# EAGLE schematic X10Relay (EAGLE 7.3.0)
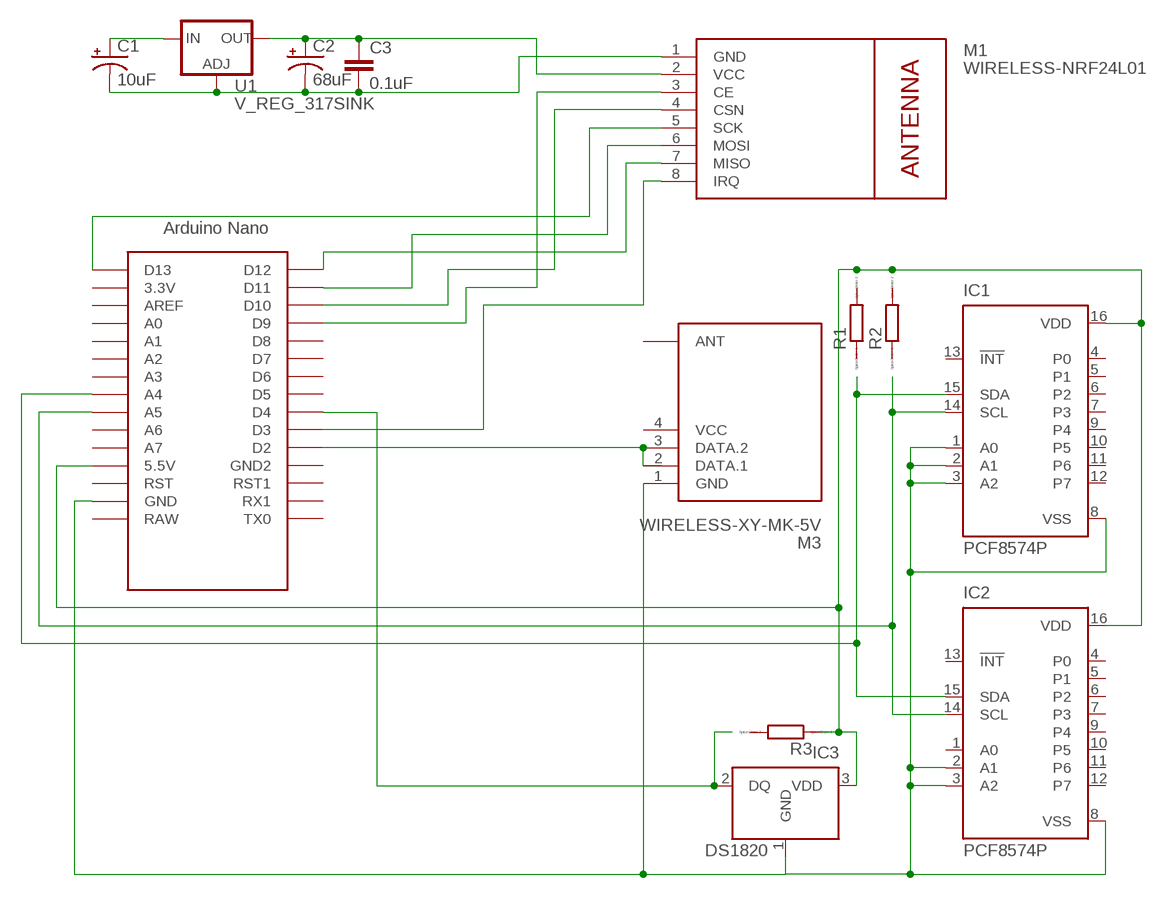
[diagram p0: schematic, sheet 1]

## Parts
C1  10uF  CAP_POL1206  [EIA3216]
C2  68uF  CAP_POL1206  [EIA3216]
C3  0.1uF  CAPEZ  [CAP-PTH-SMALLEZ]
IC1  PCF8574P  [DIL16]
IC2  PCF8574P  [DIL16]
IC3  DS1820  [TO-92]
M1  WIRELESS-NRF24L01  [WIRELESS-NRF24L01]
M3  WIRELESS-XY-MK-5V  [WIRELESS-XY-MK-5V]
R1  R  [R0805]
R2  R  [R0805]
R3  R  [R0805]
U1  V_REG_317SINK  [TO220-ADJ]
U$1  NANO  [NANO]

## Nets
N$1: IC1.1(A0) IC1.2(A1) IC1.3(A2) IC1.8(VSS) IC2.2(A1) IC2.3(A2) IC2.8(VSS) IC3.1(GND) M3.1(GND) U$1.GND
N$2: IC1.15(SDA) IC2.15(SDA) U$1.A4
N$3: C1.A(+) U1.IN
N$4: IC1.14(SCL) IC2.14(SCL) U$1.A5
N$5: C2.A(+) C3.1 M1.2(VCC) U1.OUT
N$6: M1.3(CE) U$1.D9
N$7: M1.4(CSN) U$1.D10
N$8: M1.7(MISO) U$1.D12
N$9: M1.6(MOSI) U$1.D11
N$10: M1.5(SCK) U$1.D13
N$11: M3.3(DATA.2) U$1.D2
N$12: IC1.16(VDD) IC2.16(VDD) IC3.3(VDD) R3.1 U$1.5V(5.5V)
N$13: M1.8(IRQ) U$1.D3
N$20: IC3.2(DQ) U$1.D4
N$22: C1.C(-) C2.C(-) C3.2 M1.1(GND) U1.ADJ
Unconnected: IC1.4(P0) IC1.5(P1) IC1.6(P2) IC1.7(P3) IC1.9(P4) IC1.10(P5) IC1.11(P6) IC1.12(P7) IC1.13(!INT) IC2.1(A0) IC2.4(P0) IC2.5(P1) IC2.6(P2) IC2.7(P3) IC2.9(P4) IC2.10(P5) IC2.11(P6) IC2.12(P7) IC2.13(!INT) M3.2(DATA.1) M3.4(VCC) M3.ANT R1.1 R1.2 R2.1 R2.2 R3.2 U$1.3.3V U$1.A0 U$1.A1 U$1.A2 U$1.A3 U$1.A6 U$1.A7 U$1.AREF U$1.D5 U$1.D6 U$1.D7 U$1.D8 U$1.GND1(GND2) U$1.ICSP1 U$1.ICSP2 U$1.ICSP3 U$1.ICSP4 U$1.ICSP5 U$1.ICSP6 U$1.RAW U$1.RST U$1.RST1 U$1.RX1 U$1.TX0

## Library data of the parts
C1 C2 = SparkFun-Passives:CAP_POL: Capacitor Polarized These are standard SMD and PTH capacitors. Normally 10uF, 47uF, and 100uF in electrolytic and tantalum varieties. Always verify the external diameter of the through hole cap, it varies with capacity, voltage, and manufacturer. The EIA devices should be standard.
C3 = SparkFun-Passives:CAP: Capacitor Standard 0603 ceramic capacitor, and 0.1" leaded capacitor.
IC1 IC2 = micro-philips:PCF8574: I2C-Bus Remote 8-bit I/O expander http://www.semiconductors.philips.com/acrobat_download/datasheets/PCF8574_4.pdf; MPN: PCF8574PN; OC_FARNELL: 204020; OC_NEWARK: 11N8515
IC3 = DS1820:DS1820: DS1820 - 1-Wire Digital Thermometer
M1 = diy-modules:WIRELESS-NRF24L01: 2.4 GHz Wireless Module based on NRF24L01 chip
M3 = diy-modules:WIRELESS-XY-MK-5V: RF Wireless XY-MK-5V Receiver
R1-R3 = eagle-ltspice:R: RESISTOR, European symbol; SPICEMODEL: NONE; SPICEPREFIX: R
U1 = SparkFun-PowerIC:V_REG_317: Voltage Regulator Standard LM317 adjustable voltage regulator. AOI (Adjust Output Input). Google 'LM317 Calculator' for easy to use app to get the two resistor values needed. 240/720 for 5V output. 240/390 for 3.3V output. Spark Fun Electronics SKU : COM-00527
U$1 = Arduino-clone:NANO: Arduino Nano